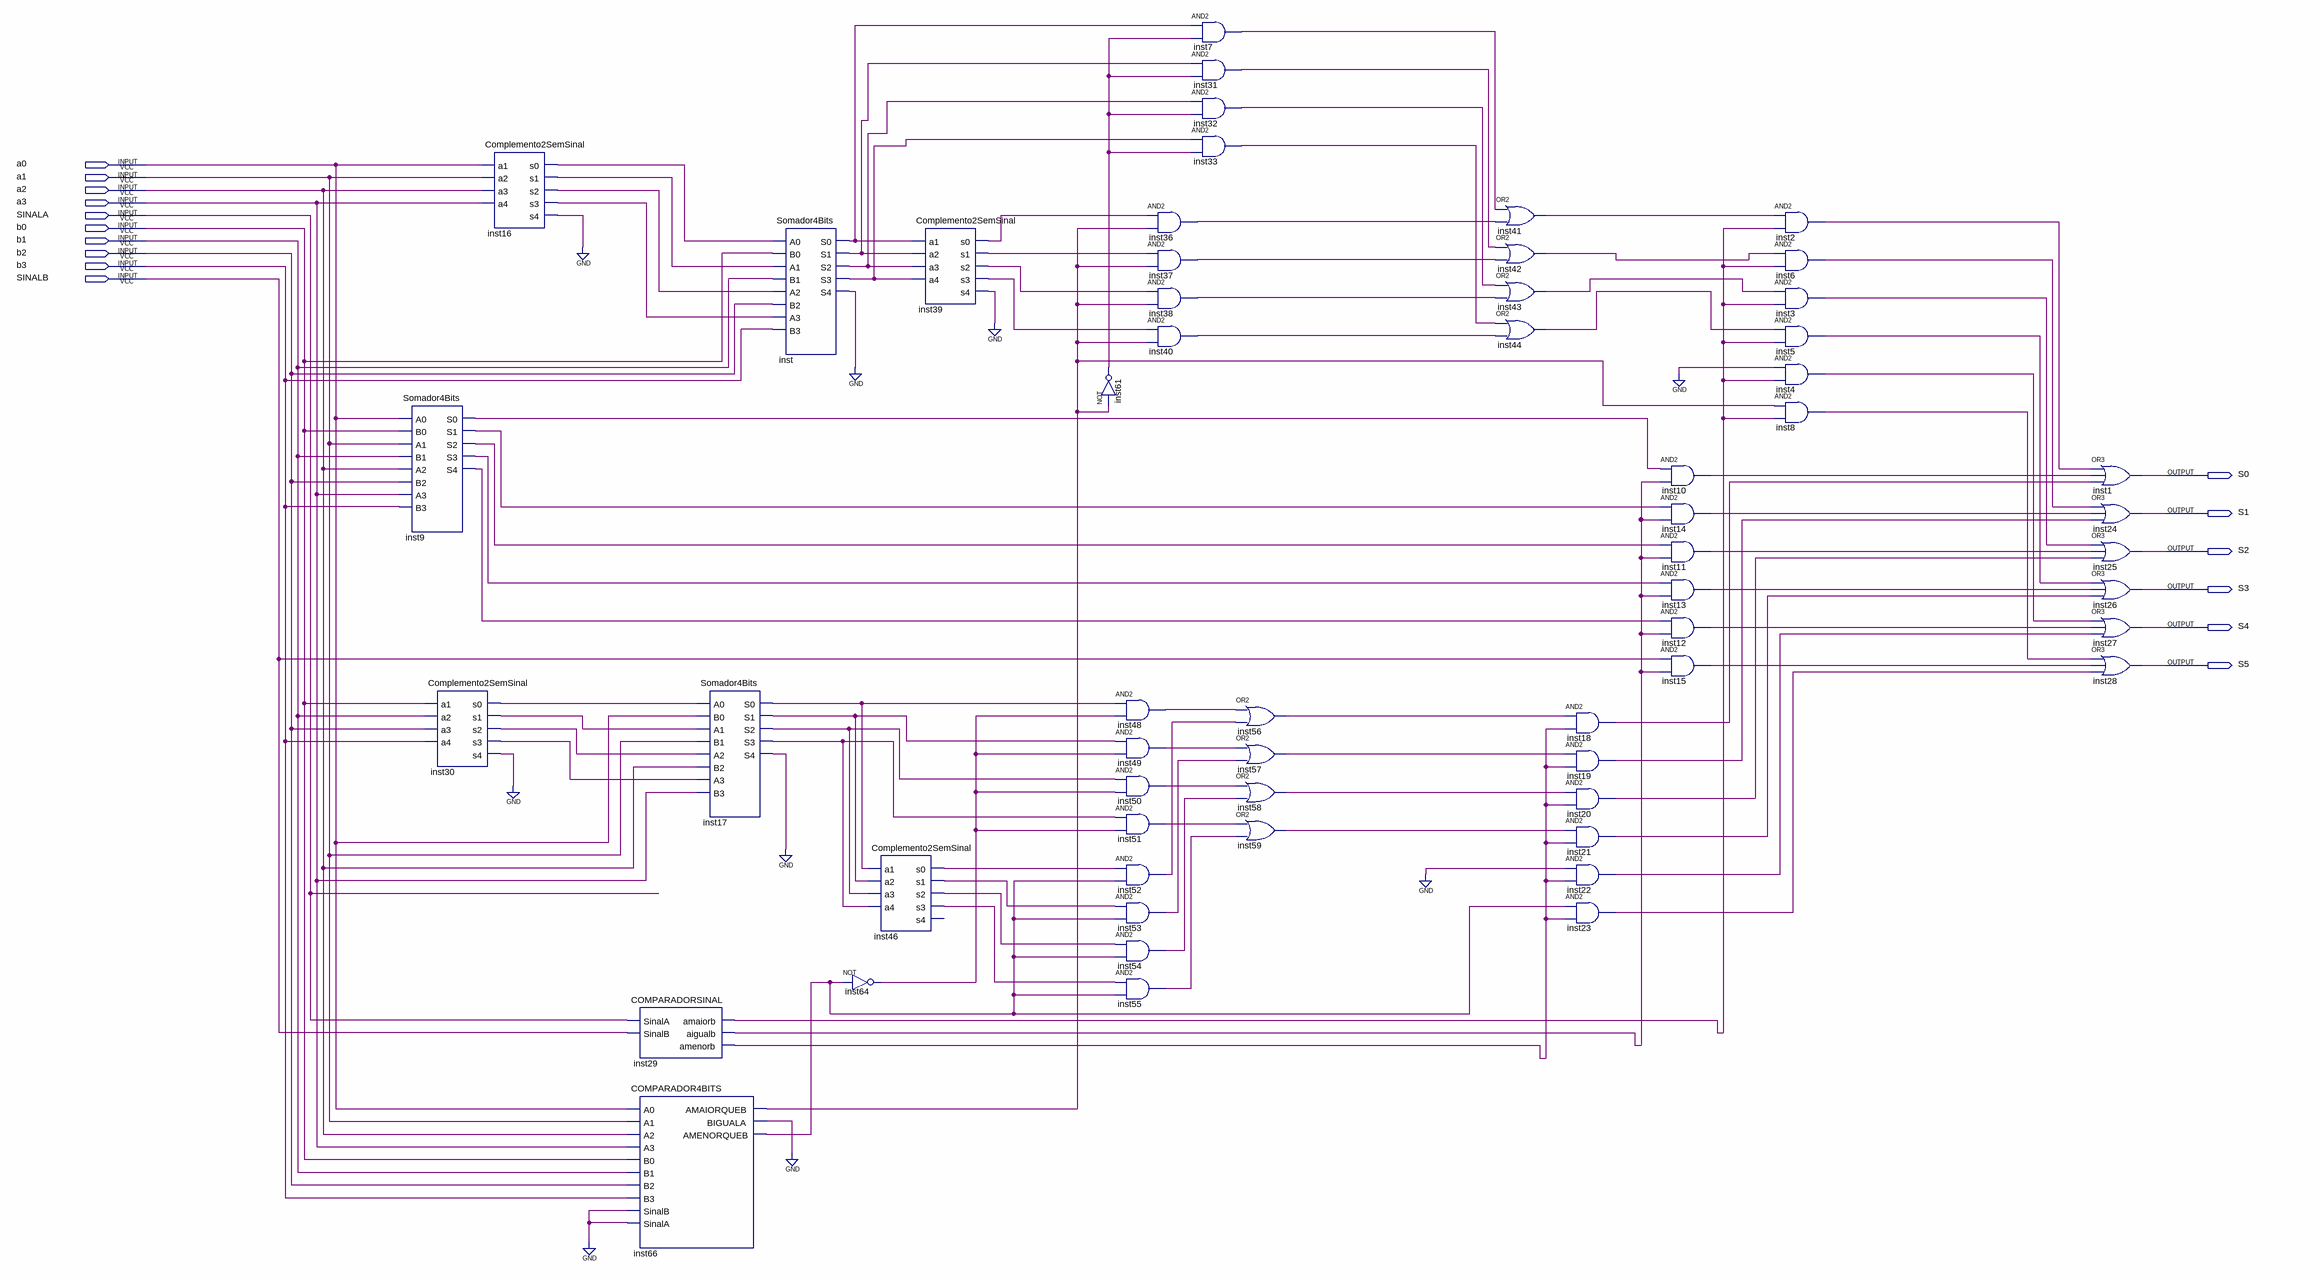
[diagram p0: schematic sheet]
// Quartus schematic SomadorModulo.bdf as structural Verilog: 59 symbols, 16 pins
module SomadorModulo (
  input  a0,
  input  a1,
  input  a2,
  input  a3,
  input  SINALA,
  input  b0,
  input  b1,
  input  b2,
  input  b3,
  input  SINALB,
  output S0,
  output S1,
  output S2,
  output S3,
  output S4,
  output S5
);

  wire inst2_out, inst3_out, inst4_out, inst5_out, inst6_out, inst7_out, inst8_out, inst9_s0, inst9_s1,
       inst9_s2, inst9_s3, inst9_s4, inst10_out, inst11_out, inst12_out, inst13_out, inst14_out, inst15_out,
       inst16_s0, inst16_s1, inst16_s2, inst16_s3, inst16_s4, inst17_s0, inst17_s1, inst17_s2, inst17_s3,
       inst17_s4, inst18_out, inst19_out, inst20_out, inst21_out, inst22_out, inst23_out, inst29_aigualb,
       inst29_amaiorb, inst29_amenorb, inst30_s0, inst30_s1, inst30_s2, inst30_s3, inst30_s4, inst31_out,
       inst32_out, inst33_out, inst36_out, inst37_out, inst38_out, inst39_s0, inst39_s1, inst39_s2,
       inst39_s3, inst39_s4, inst40_out, inst41_out, inst42_out, inst43_out, inst44_out, inst46_s0,
       inst46_s1, inst46_s2, inst46_s3, inst48_out, inst49_out, inst50_out, inst51_out, inst52_out,
       inst53_out, inst54_out, inst55_out, inst56_out, inst57_out, inst58_out, inst59_out, inst61_out,
       inst64_out, inst66_amaiorqueb, inst66_amenorqueb, inst66_biguala, inst_s0, inst_s1, inst_s2, inst_s3,
       inst_s4;

  Somador4Bits inst9 (
    .A0(a0), .B0(b0), .A1(a1), .B1(b1), .A2(a2), .B2(b2), .A3(a3), .B3(b3), .S0(inst9_s0), .S1(inst9_s1),
    .S2(inst9_s2), .S3(inst9_s3), .S4(inst9_s4));
  Complemento2SemSinal inst30 (
    .a1(b0), .a2(b1), .a3(b2), .a4(b3), .s0(inst30_s0), .s1(inst30_s1), .s2(inst30_s2), .s3(inst30_s3),
    .s4(inst30_s4));
  Complemento2SemSinal inst16 (
    .a1(a0), .a2(a1), .a3(a2), .a4(a3), .s0(inst16_s0), .s1(inst16_s1), .s2(inst16_s2), .s3(inst16_s3),
    .s4(inst16_s4));
  COMPARADORSINAL inst29 (
    .SinalA(SINALA), .SinalB(SINALB), .amaiorb(inst29_amaiorb), .aigualb(inst29_aigualb),
    .amenorb(inst29_amenorb));
  COMPARADOR4BITS inst66 (
    .A0(a0), .A1(a1), .A2(a2), .A3(a3), .B0(b0), .B1(b1), .B2(b2), .B3(b3), .SinalB(1'b0), .SinalA(1'b0),
    .AMAIORQUEB(inst66_amaiorqueb), .BIGUALA(inst66_biguala), .AMENORQUEB(inst66_amenorqueb));
  Somador4Bits inst17 (
    .A0(inst30_s0), .B0(a0), .A1(inst30_s1), .B1(a1), .A2(inst30_s2), .B2(a2), .A3(inst30_s3), .B3(a3),
    .S0(inst17_s0), .S1(inst17_s1), .S2(inst17_s2), .S3(inst17_s3), .S4(inst17_s4));
  Somador4Bits inst (
    .A0(inst16_s0), .B0(b0), .A1(inst16_s1), .B1(b1), .A2(inst16_s2), .B2(b2), .A3(inst16_s3), .B3(b3),
    .S0(inst_s0), .S1(inst_s1), .S2(inst_s2), .S3(inst_s3), .S4(inst_s4));
  Complemento2SemSinal inst46 (
    .a1(inst17_s0), .a2(inst17_s1), .a3(inst17_s2), .a4(inst17_s3), .s0(inst46_s0), .s1(inst46_s1),
    .s2(inst46_s2), .s3(inst46_s3));  // open: s4
  not inst64 (inst64_out, inst66_amenorqueb);
  Complemento2SemSinal inst39 (
    .a1(inst_s0), .a2(inst_s1), .a3(inst_s2), .a4(inst_s3), .s0(inst39_s0), .s1(inst39_s1), .s2(inst39_s2),
    .s3(inst39_s3), .s4(inst39_s4));
  not inst61 (inst61_out, inst66_amaiorqueb);
  and inst48 (inst48_out, inst17_s0, inst64_out);
  and inst49 (inst49_out, inst17_s1, inst64_out);
  and inst50 (inst50_out, inst17_s2, inst64_out);
  and inst51 (inst51_out, inst17_s3, inst64_out);
  and inst52 (inst52_out, inst46_s0, inst66_amenorqueb);
  and inst53 (inst53_out, inst46_s1, inst66_amenorqueb);
  and inst54 (inst54_out, inst46_s2, inst66_amenorqueb);
  and inst55 (inst55_out, inst46_s3, inst66_amenorqueb);
  and inst7 (inst7_out, inst_s0, inst61_out);
  and inst31 (inst31_out, inst_s1, inst61_out);
  and inst32 (inst32_out, inst_s2, inst61_out);
  and inst33 (inst33_out, inst_s3, inst61_out);
  and inst36 (inst36_out, inst39_s0, inst66_amaiorqueb);
  and inst37 (inst37_out, inst39_s1, inst66_amaiorqueb);
  and inst38 (inst38_out, inst39_s2, inst66_amaiorqueb);
  and inst40 (inst40_out, inst39_s3, inst66_amaiorqueb);
  or inst56 (inst56_out, inst48_out, inst52_out);
  or inst57 (inst57_out, inst49_out, inst53_out);
  or inst58 (inst58_out, inst50_out, inst54_out);
  or inst59 (inst59_out, inst51_out, inst55_out);
  or inst41 (inst41_out, inst7_out, inst36_out);
  or inst42 (inst42_out, inst31_out, inst37_out);
  or inst43 (inst43_out, inst32_out, inst38_out);
  or inst44 (inst44_out, inst33_out, inst40_out);
  and inst18 (inst18_out, inst56_out, inst29_amenorb);
  and inst19 (inst19_out, inst57_out, inst29_amenorb);
  and inst20 (inst20_out, inst58_out, inst29_amenorb);
  and inst21 (inst21_out, inst59_out, inst29_amenorb);
  and inst22 (inst22_out, 1'b0, inst29_amenorb);
  and inst23 (inst23_out, inst66_amenorqueb, inst29_amenorb);
  and inst10 (inst10_out, inst9_s0, inst29_aigualb);
  and inst14 (inst14_out, inst9_s1, inst29_aigualb);
  and inst11 (inst11_out, inst9_s2, inst29_aigualb);
  and inst13 (inst13_out, inst9_s3, inst29_aigualb);
  and inst12 (inst12_out, inst9_s4, inst29_aigualb);
  and inst15 (inst15_out, SINALB, inst29_aigualb);
  and inst2 (inst2_out, inst41_out, inst29_amaiorb);
  and inst6 (inst6_out, inst42_out, inst29_amaiorb);
  and inst3 (inst3_out, inst43_out, inst29_amaiorb);
  and inst5 (inst5_out, inst44_out, inst29_amaiorb);
  and inst4 (inst4_out, 1'b0, inst29_amaiorb);
  and inst8 (inst8_out, inst66_amaiorqueb, inst29_amaiorb);
  or inst1 (S0, inst2_out, inst10_out, inst18_out);
  or inst24 (S1, inst6_out, inst14_out, inst19_out);
  or inst25 (S2, inst3_out, inst11_out, inst20_out);
  or inst26 (S3, inst5_out, inst13_out, inst21_out);
  or inst27 (S4, inst4_out, inst12_out, inst22_out);
  or inst28 (S5, inst8_out, inst15_out, inst23_out);
  // also tied to GND on the sheet: {inst39_s4, inst_s4, inst17_s4, inst30_s4, inst16_s4, inst66_biguala}
endmodule
